# EasyEDA Pro project EasyEDA ProPrj_FL7333_2026-01-03.epro

# Board platine
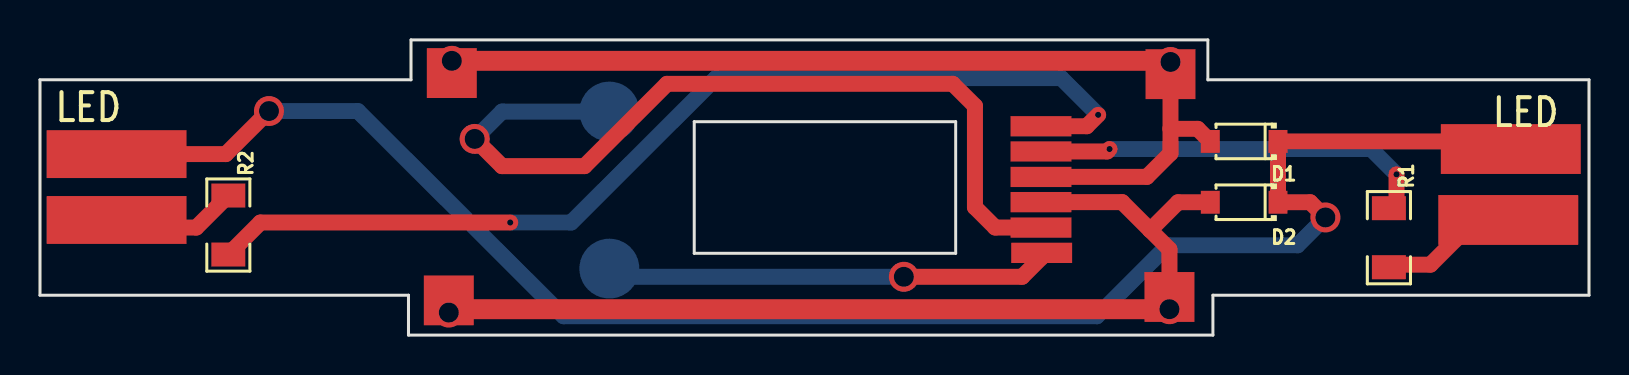
[diagram p0: board, top side]
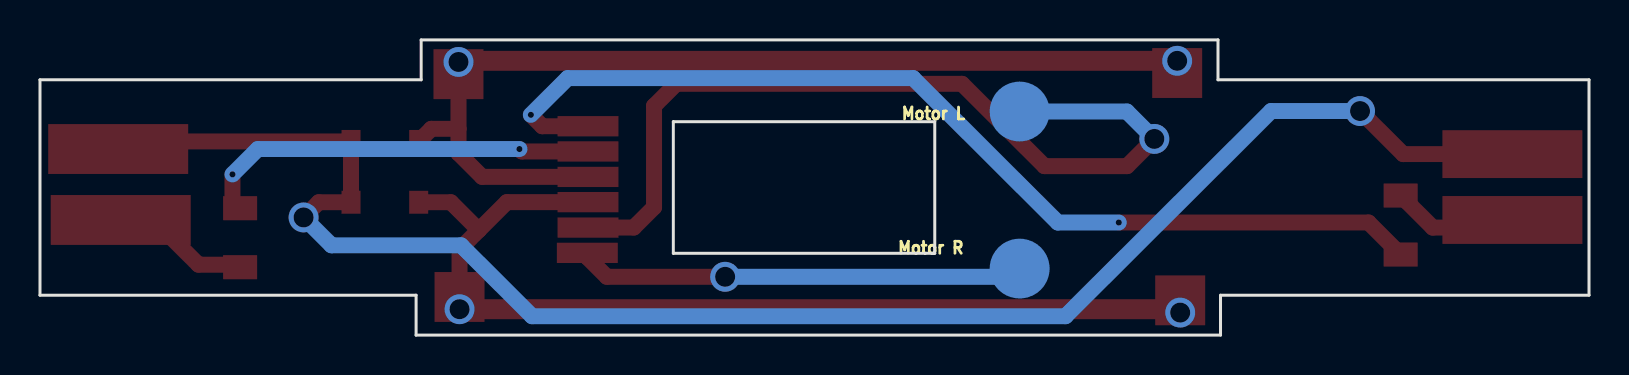
[diagram p1: board, bottom side, seen from below]

Outline 77.47 x 14.8 mm; copper layers: Top Layer, Bottom Layer. Coordinates in mm from the lower left corner of the outline.
Outline path: 0,12.8 18.55,12.8 18.55,14.8 58.4,14.8 58.4,12.8 77.47,12.8 77.47,2 58.66,2 58.66,0 18.43,0 18.43,2 0,2 0,12.8 ; 32.72,10.7 45.79,10.7 45.79,4.1 32.72,4.1 32.72,10.7
Stack: Top Layer 0.035mm / Dielectric1 1.51mm FR4 er 4.5 / Bottom Layer 0.035mm

## Design rules (mm)
spacing safeClearance (default): track to track 0.152, other pairs 0.152 to 0.3
track width trackWidth (default): min 0.127, default 0.254, max 2.54
differential pair differentialPair (default): width min 0.127, default 0.254, max 2.54; gap min 0.152, default 0.152
via viaSize (default): diameter min 0.5, default 0.61, max 10; hole min 0.3, default 0.305, max 6

## Placement (name value [footprint] x y rotation side)
D1  1N4148W  [SOD-123_L2.8-W1.8-LS3.7-RD-1]  60.22 9.71 180 top
D2  1N4148W  [SOD-123_L2.8-W1.8-LS3.7-RD-1]  60.22 6.66 180 top
Motor L  SolderWirePad_1x01_SMD_3x3mm  [SMDPad3x3mm:SolderWirePad_1x01_SMD_3x3mm]  28.72 9.71 180 bottom
Motor R  SolderWirePad_1x01_SMD_3x3mm  [SMDPad3x3mm:SolderWirePad_1x01_SMD_3x3mm]  28.72 1.83 180 bottom
NOREF  -  [Pad_e368]  73.43 5.77 0 top
NOREF#2  -  [Pad_e233]  50.06 9.21 0 top
NOREF#3  -  [Pad_e237]  50.09 4.12 0 top
NOREF#4  -  [Pad_e371]  3.83 5.77 0 top
NOREF#5  -  [Pad_e798]  3.83 9.07 0 top
NOREF#6  -  [Pad_e236]  50.06 5.39 0 top
NOREF#7  -  [Pad_e443]  56.54 13.08 0 top
NOREF#8  -  [Pad_e431]  56.48 1.91 180 top
NOREF#9  -  [Pad_e234]  50.06 7.93 0 top
NOREF#10  -  [Pad_e780]  73.55 9.33 0 top
NOREF#11  -  [Pad_e235]  50.06 6.67 0 top
NOREF#12  -  [Pad_e416]  20.59 13.14 0 top
NOREF#13  -  [Pad_e427]  20.44 1.74 180 top
NOREF#14  -  [Pad_e232]  50.06 10.47 0 top
R1  -  [R1206]  67.46 4.88 270 top
R2  1kΩ  [R1206]  9.42 5.52 270 top

## Footprints (pads in the part's own frame, mm; a bottom-side part is the same pattern mirrored in y, then rotated)
Pad_e232
  rect 3.048x1.016 smd: 6(0,0)
Pad_e233
  rect 3.048x1.016 smd: 5(0,0)
Pad_e234
  rect 3.048x1.016 smd: 4(0,0)
Pad_e235
  rect 3.048x1.016 smd: 3(0,0)
Pad_e236
  rect 3.048x1.016 smd: 2(0,0)
Pad_e237
  rect 3.048x1.016 smd: 1(0,0)
Pad_e368
  rect 7x2.5 smd: 4(0,0)
Pad_e371
  rect 7x2.4 smd: 4(0,0)
Pad_e416
  rect 2.5x2.5 smd: 4(0,0)
Pad_e427
  rect 2.5x2.5 smd: 4(0,0)
Pad_e431
  rect 2.5x2.5 smd: 4(0,0)
Pad_e443
  rect 2.5x2.5 smd: 4(0,0)
Pad_e780
  rect 7x2.5 smd: VCC(0,0)
Pad_e798
  rect 7x2.4 smd: 4(0,0)
R1206
  rect 1.208x1.701 smd: 1(-1.479,0) 2(1.479,0)
SMDPad3x3mm:SolderWirePad_1x01_SMD_3x3mm
  rrect 3x3 smd: 1(0.25,1.5)
SOD-123_L2.8-W1.8-LS3.7-RD-1
  rect 0.95x1.15 smd: 1(-1.692,0) 2(1.692,0)

## Nets
+: D1.1 D2.1 NOREF#5.4 NOREF#10.VCC
GLEISL: D1.2 NOREF#7.4 NOREF#9.4 NOREF#12.4
GLEISR: D2.2 NOREF#8.4 NOREF#11.3 NOREF#13.4
LEDH: NOREF#4.4 R2.1
LEDV: NOREF.4 R1.2
LICHTH: NOREF#14.6 R2.2
LICHTV: NOREF#2.5 R1.1
MOTOR_A: Motor R.1 NOREF#3.1
MOTOR_B: Motor L.1 NOREF#6.2

## Via types
v1: diameter 1.5, hole 1, Top Layer to Bottom Layer, 8 vias
v2: diameter 0.61, hole 0.305, Top Layer to Bottom Layer, 4 vias

## Routing (per net, layer and track width the routed paths; a pad name or vN(x,y) marks a point on that pad's centre or on a via; arc(x,y) is an arc through that point)
+: length 85.7
  Top Layer w0.8: v1(11.45,11.23) 9.29,9.07 NOREF#5.4 ; v1(64.28,5.9) 63.52,6.66 D2.1 D1.1 72.92,9.71 73.81,8.82
  Bottom Layer w0.8: v1(11.45,11.23) 15.9,11.23 26.18,0.95 52.85,0.95 56.41,4.5 62.89,4.5 v1(64.28,5.9)
GLEISL: length 49.8
  Top Layer w0.8: v1(56.54,13.69) 56.54,10.34 ; 56.54,10.34 57.89,10.34 D1.2 ; 56.54,10.34 56.54,9.12 55.35,7.93 50.06,7.93
  Top Layer w1: v1(20.59,13.75) 56.48,13.75 v1(56.54,13.69)
GLEISR: length 50.1
  Top Layer w0.8: NOREF#11.3 54.12,6.67 55.52,5.26 ; D2.2 56.92,6.66 55.52,5.26 ; 55.52,5.26 56.48,4.3 NOREF#8.4 ; 20.89,1.3 NOREF#13.4
  Top Layer w1: v1(56.48,1.3) 20.61,1.3 v1(20.44,1.13)
LEDH: length 6.4
  Top Layer w0.8: R2.1 7.81,5.39 4.21,5.39 NOREF#4.4
LEDV: length 7.4
  Top Layer w0.8: 73.81,5.77 73.68,5.9 71.9,5.9 69.53,3.53 67.59,3.53 R1.2
LICHTH: length 51
  Top Layer w0.8: v2(23.52,5.64) 11.03,5.64 R2.2 ; v2(52.92,11.04) 52.34,10.47 NOREF#14.6
  Bottom Layer w0.8: v2(23.52,5.64) 26.56,5.64 33.8,12.88 51.07,12.88 v2(52.92,11.04)
LICHTV: length 20.2
  Top Layer w0.8: v2(67.84,8.06) 67.84,6.74 R1.1 ; NOREF#2.5 53.37,9.21 v2(53.49,9.33)
  Bottom Layer w0.8: v2(53.49,9.33) 66.57,9.33 v2(67.84,8.06)
MOTOR_A: length 22.4
  Top Layer w0.8: v1(43.2,2.92) 49.12,2.92 50.09,3.9 NOREF#3.1
  Bottom Layer w0.8: v1(43.2,2.92) 28.88,2.92 Motor R.1
MOTOR_B: length 43.9
  Top Layer w0.8: 50.06,5.39 47.77,5.39 46.76,6.41 46.76,11.49 45.65,12.6 31.36,12.6 27.23,8.47 23.1,8.47 v1(21.74,9.84)
  Bottom Layer w0.8: Motor L.1 23.11,11.21 v1(21.74,9.84)

## Text on the board
Top Silkscreen Layer: LED
